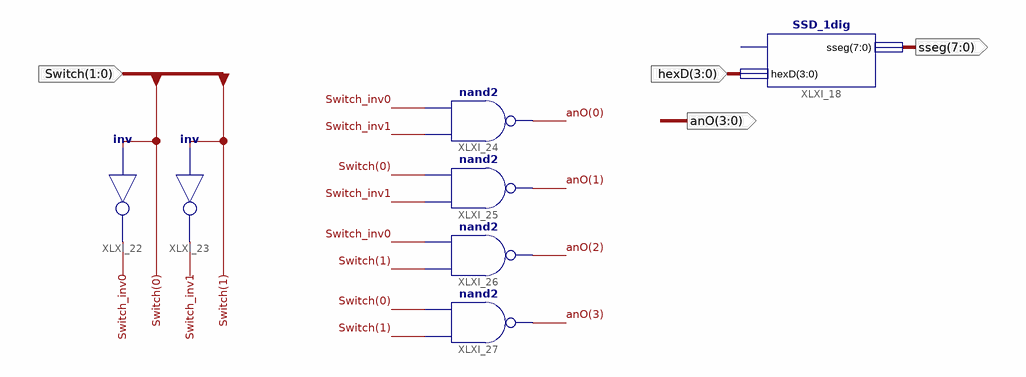
[diagram p0: schematic sheet 1]
// Xilinx ISE schematic Lab6_Ex6.sch (spartan3e) as structural Verilog: 7 symbols, 4 ports
module Lab6_Ex6 (
  input  [1:0] Switch,
  input  [3:0] hexD,
  output [7:0] sseg,
  output [3:0] anO
);

  wire Switch_inv0, Switch_inv1;

  not XLXI_22 (Switch_inv0, Switch[0]);
  not XLXI_23 (Switch_inv1, Switch[1]);
  nand XLXI_24 (anO[0], Switch_inv1, Switch_inv0);
  nand XLXI_25 (anO[1], Switch_inv1, Switch[0]);
  nand XLXI_26 (anO[2], Switch[1], Switch_inv0);
  nand XLXI_27 (anO[3], Switch[1], Switch[0]);
  SSD_1dig XLXI_18 (.hexD(hexD), .sseg(sseg));  // open: dp_in
endmodule
